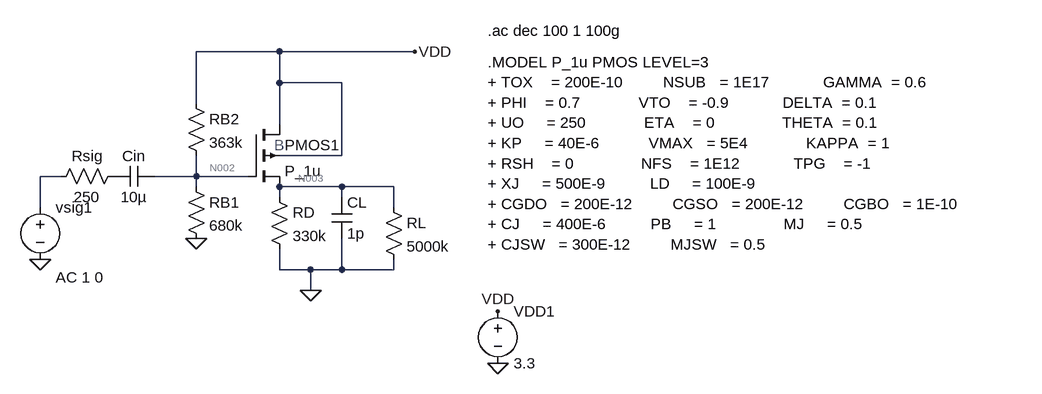
[diagram p0: schematic Simu_gain_Rsig_Rl.asc]
Simu_gain_Rsig_Rl.asc, the LTspice schematic file:
Version 4
SHEET 1 1124 680
WIRE -48 -112 -176 -112
WIRE 160 -112 -48 -112
WIRE -48 -64 -48 -112
WIRE 48 -64 -48 -64
WIRE -176 -32 -176 -112
WIRE -48 0 -48 -64
WIRE 48 48 48 -64
WIRE 48 48 -48 48
WIRE -384 80 -416 80
WIRE -176 80 -176 48
WIRE -176 80 -240 80
WIRE -96 80 -176 80
WIRE -176 96 -176 80
WIRE 48 96 -48 96
WIRE 128 96 48 96
WIRE -48 112 -48 96
WIRE 48 112 48 96
WIRE -416 128 -416 80
WIRE 128 128 128 96
WIRE -48 224 -48 192
WIRE 0 224 -48 224
WIRE 48 224 48 176
WIRE 48 224 0 224
WIRE 128 224 128 208
WIRE 128 224 48 224
WIRE 0 256 0 224
FLAG 160 -112 VDD
FLAG -176 176 0
FLAG -416 208 0
FLAG 288 368 0
FLAG 288 288 VDD
FLAG 0 256 0
SYMBOL voltage -416 112 R0
WINDOW 123 24 124 Left 2
WINDOW 39 0 0 Left 0
SYMATTR Value2 AC 1 0
SYMATTR InstName vsig1
SYMATTR Value ""
SYMBOL cap -240 64 R90
WINDOW 0 0 32 VBottom 2
WINDOW 3 32 32 VTop 2
SYMATTR InstName Cin
SYMATTR Value 10µ
SYMBOL res -192 80 R0
SYMATTR InstName RB1
SYMATTR Value 680k
SYMBOL res -192 -48 R0
SYMATTR InstName RB2
SYMATTR Value 363k
SYMBOL res -64 96 R0
SYMATTR InstName RD
SYMATTR Value 330k
SYMBOL cap 32 112 R0
SYMATTR InstName CL
SYMATTR Value 1p
SYMBOL pmos4 -96 0 R0
SYMATTR InstName PMOS1
SYMATTR Value P_1u
SYMATTR Value2 l=1u w=2.5u
SYMBOL voltage 288 272 R0
WINDOW 123 0 0 Left 0
WINDOW 39 0 0 Left 0
SYMATTR InstName VDD1
SYMATTR Value 3.3
SYMBOL res -288 64 R90
WINDOW 0 0 56 VBottom 2
WINDOW 3 32 56 VTop 2
SYMATTR InstName Rsig
SYMATTR Value 250
SYMBOL res 112 112 R0
SYMATTR InstName RL
SYMATTR Value 5000k
TEXT -56 32 Left 2 ;B
TEXT 272 -144 Left 2 !.ac dec 100 1 100g
TEXT 272 -96 Left 2 !.MODEL P_1u PMOS LEVEL=3\n+ TOX    = 200E-10         NSUB   = 1E17            GAMMA  = 0.6          \n+ PHI    = 0.7             VTO    = -0.9            DELTA  = 0.1          \n+ UO     = 250             ETA    = 0               THETA  = 0.1         \n+ KP     = 40E-6           VMAX   = 5E4             KAPPA  = 1         \n+ RSH    = 0               NFS    = 1E12            TPG    = -1                 \n+ XJ     = 500E-9          LD     = 100E-9               \n+ CGDO   = 200E-12         CGSO   = 200E-12         CGBO   = 1E-10              \n+ CJ     = 400E-6          PB     = 1               MJ     = 0.5                \n+ CJSW   = 300E-12         MJSW   = 0.5

The netlist it stands for:
* Simu_gain_Rsig_Rl.asc
vsig1 N001 0 AC 1 0
Cin N002 P001 10µ
RB1 N002 0 680k
RB2 VDD N002 363k
RD N003 0 330k
CL N003 0 1p
M§PMOS1 VDD N002 N003 VDD P_1u l=1u w=2.5u
VDD1 VDD 0 3.3
Rsig P001 N001 250
RL N003 0 5000k
.model NMOS NMOS
.model PMOS PMOS
.lib standard.mos
* B
.ac dec 100 1 100g
.MODEL P_1u PMOS LEVEL=3
+ TOX    = 200E-10         NSUB   = 1E17            GAMMA  = 0.6
+ PHI    = 0.7             VTO    = -0.9            DELTA  = 0.1
+ UO     = 250             ETA    = 0               THETA  = 0.1
+ KP     = 40E-6           VMAX   = 5E4             KAPPA  = 1
+ RSH    = 0               NFS    = 1E12            TPG    = -1
+ XJ     = 500E-9          LD     = 100E-9
+ CGDO   = 200E-12         CGSO   = 200E-12         CGBO   = 1E-10
+ CJ     = 400E-6          PB     = 1               MJ     = 0.5
+ CJSW   = 300E-12         MJSW   = 0.5
.backanno
.end

* Results of the author's LTspice run, read from the files saved beside the schematic
* Operating Point, zero values left out:
*   V(n002) = 2.151 V
*   V(vdd) = 3.3 V
*   V(n003) = 1.494 V
*   Id(Pmos1) = 4.827 µA
*   Ib(Pmos1) = 1.816 pA
*   Is(Pmos1) = -4.827 µA
*   I(Rl) = 298.8 nA
*   I(Rd) = 4.528 µA
*   I(Rb2) = 3.164 µA
*   I(Rb1) = 3.164 µA
*   I(Vdd1) = -7.991 µA
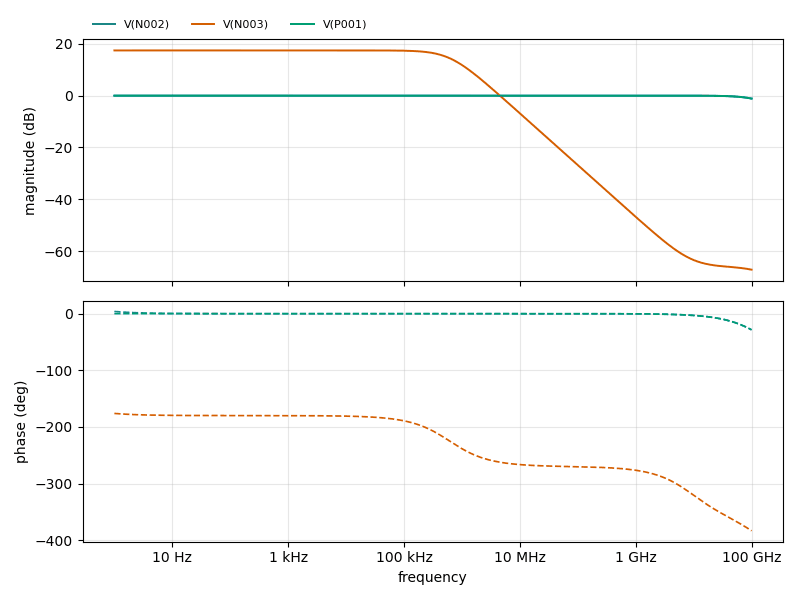
[diagram p1: AC Analysis of Simu_gain_Rsig_Rl.asc, plotted from the saved traces]
* AC Analysis, 1 run:
*   V(N002): -0.03 dB at 1 Hz, -1.14 dB at 100 GHz, peak -0.01 dB at 3.89 kHz
*   V(N003): 17.42 dB at 1 Hz, -67.13 dB at 100 GHz, peak 17.44 dB at 204.2 Hz, 3 dB below the peak at 613.5 kHz
*   V(P001): -0.01 dB at 1 Hz, -1.14 dB at 100 GHz, peak -0.01 dB at 1 Hz